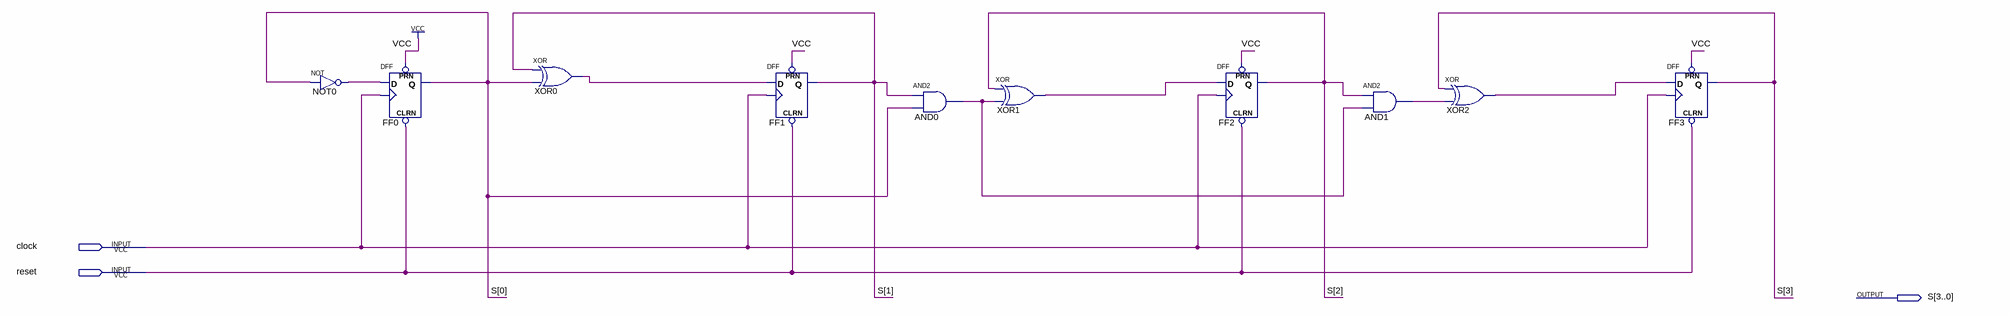
[diagram p0: schematic sheet]
// Quartus schematic sync_counter.bdf as structural Verilog: 10 symbols, 3 pins
module sync_counter (
  input  clock,
  input  reset,
  output [3:0] S
);

  wire AND0_out, AND1_out, NOT0_out, XOR0_out, XOR1_out, XOR2_out;

  not NOT0 (NOT0_out, S[0]);
  DFF FF0 (.CLRN(reset), .CLK(clock), .D(NOT0_out), .PRN(1'b1), .Q(S[0]));
  xor XOR0 (XOR0_out, S[1], S[0]);
  DFF FF1 (.CLRN(reset), .CLK(clock), .D(XOR0_out), .PRN(1'b1), .Q(S[1]));
  and AND0 (AND0_out, S[1], S[0]);
  xor XOR1 (XOR1_out, S[2], AND0_out);
  DFF FF2 (.CLRN(reset), .CLK(clock), .D(XOR1_out), .PRN(1'b1), .Q(S[2]));
  and AND1 (AND1_out, S[2], AND0_out);
  xor XOR2 (XOR2_out, S[3], AND1_out);
  DFF FF3 (.CLRN(reset), .CLK(clock), .D(XOR2_out), .PRN(1'b1), .Q(S[3]));
endmodule
